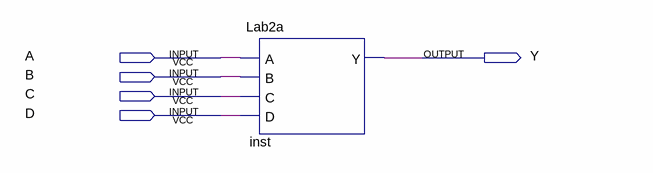
[diagram p0: schematic sheet]
// Quartus schematic Lab2b.bdf as structural Verilog: 1 symbols, 5 pins
module Lab2b (
  input  A,
  input  B,
  input  C,
  input  D,
  output Y
);

  Lab2a inst (.A(A), .B(B), .C(C), .D(D), .Y(Y));
endmodule
